# EasyEDA Pro project 无刷双驱_2025-10-18.epro, schematic Schematic1_1

## Sheets
1 P1: Board Name: Board1_1; Create Date: 2025-07-11; Page Name: P1; Project Name: 0708; Schematic Name: Schematic1_1; Update Date: 2025-07-11; Company: 嘉立创EDA; Page Size: A4; Version: V1.0
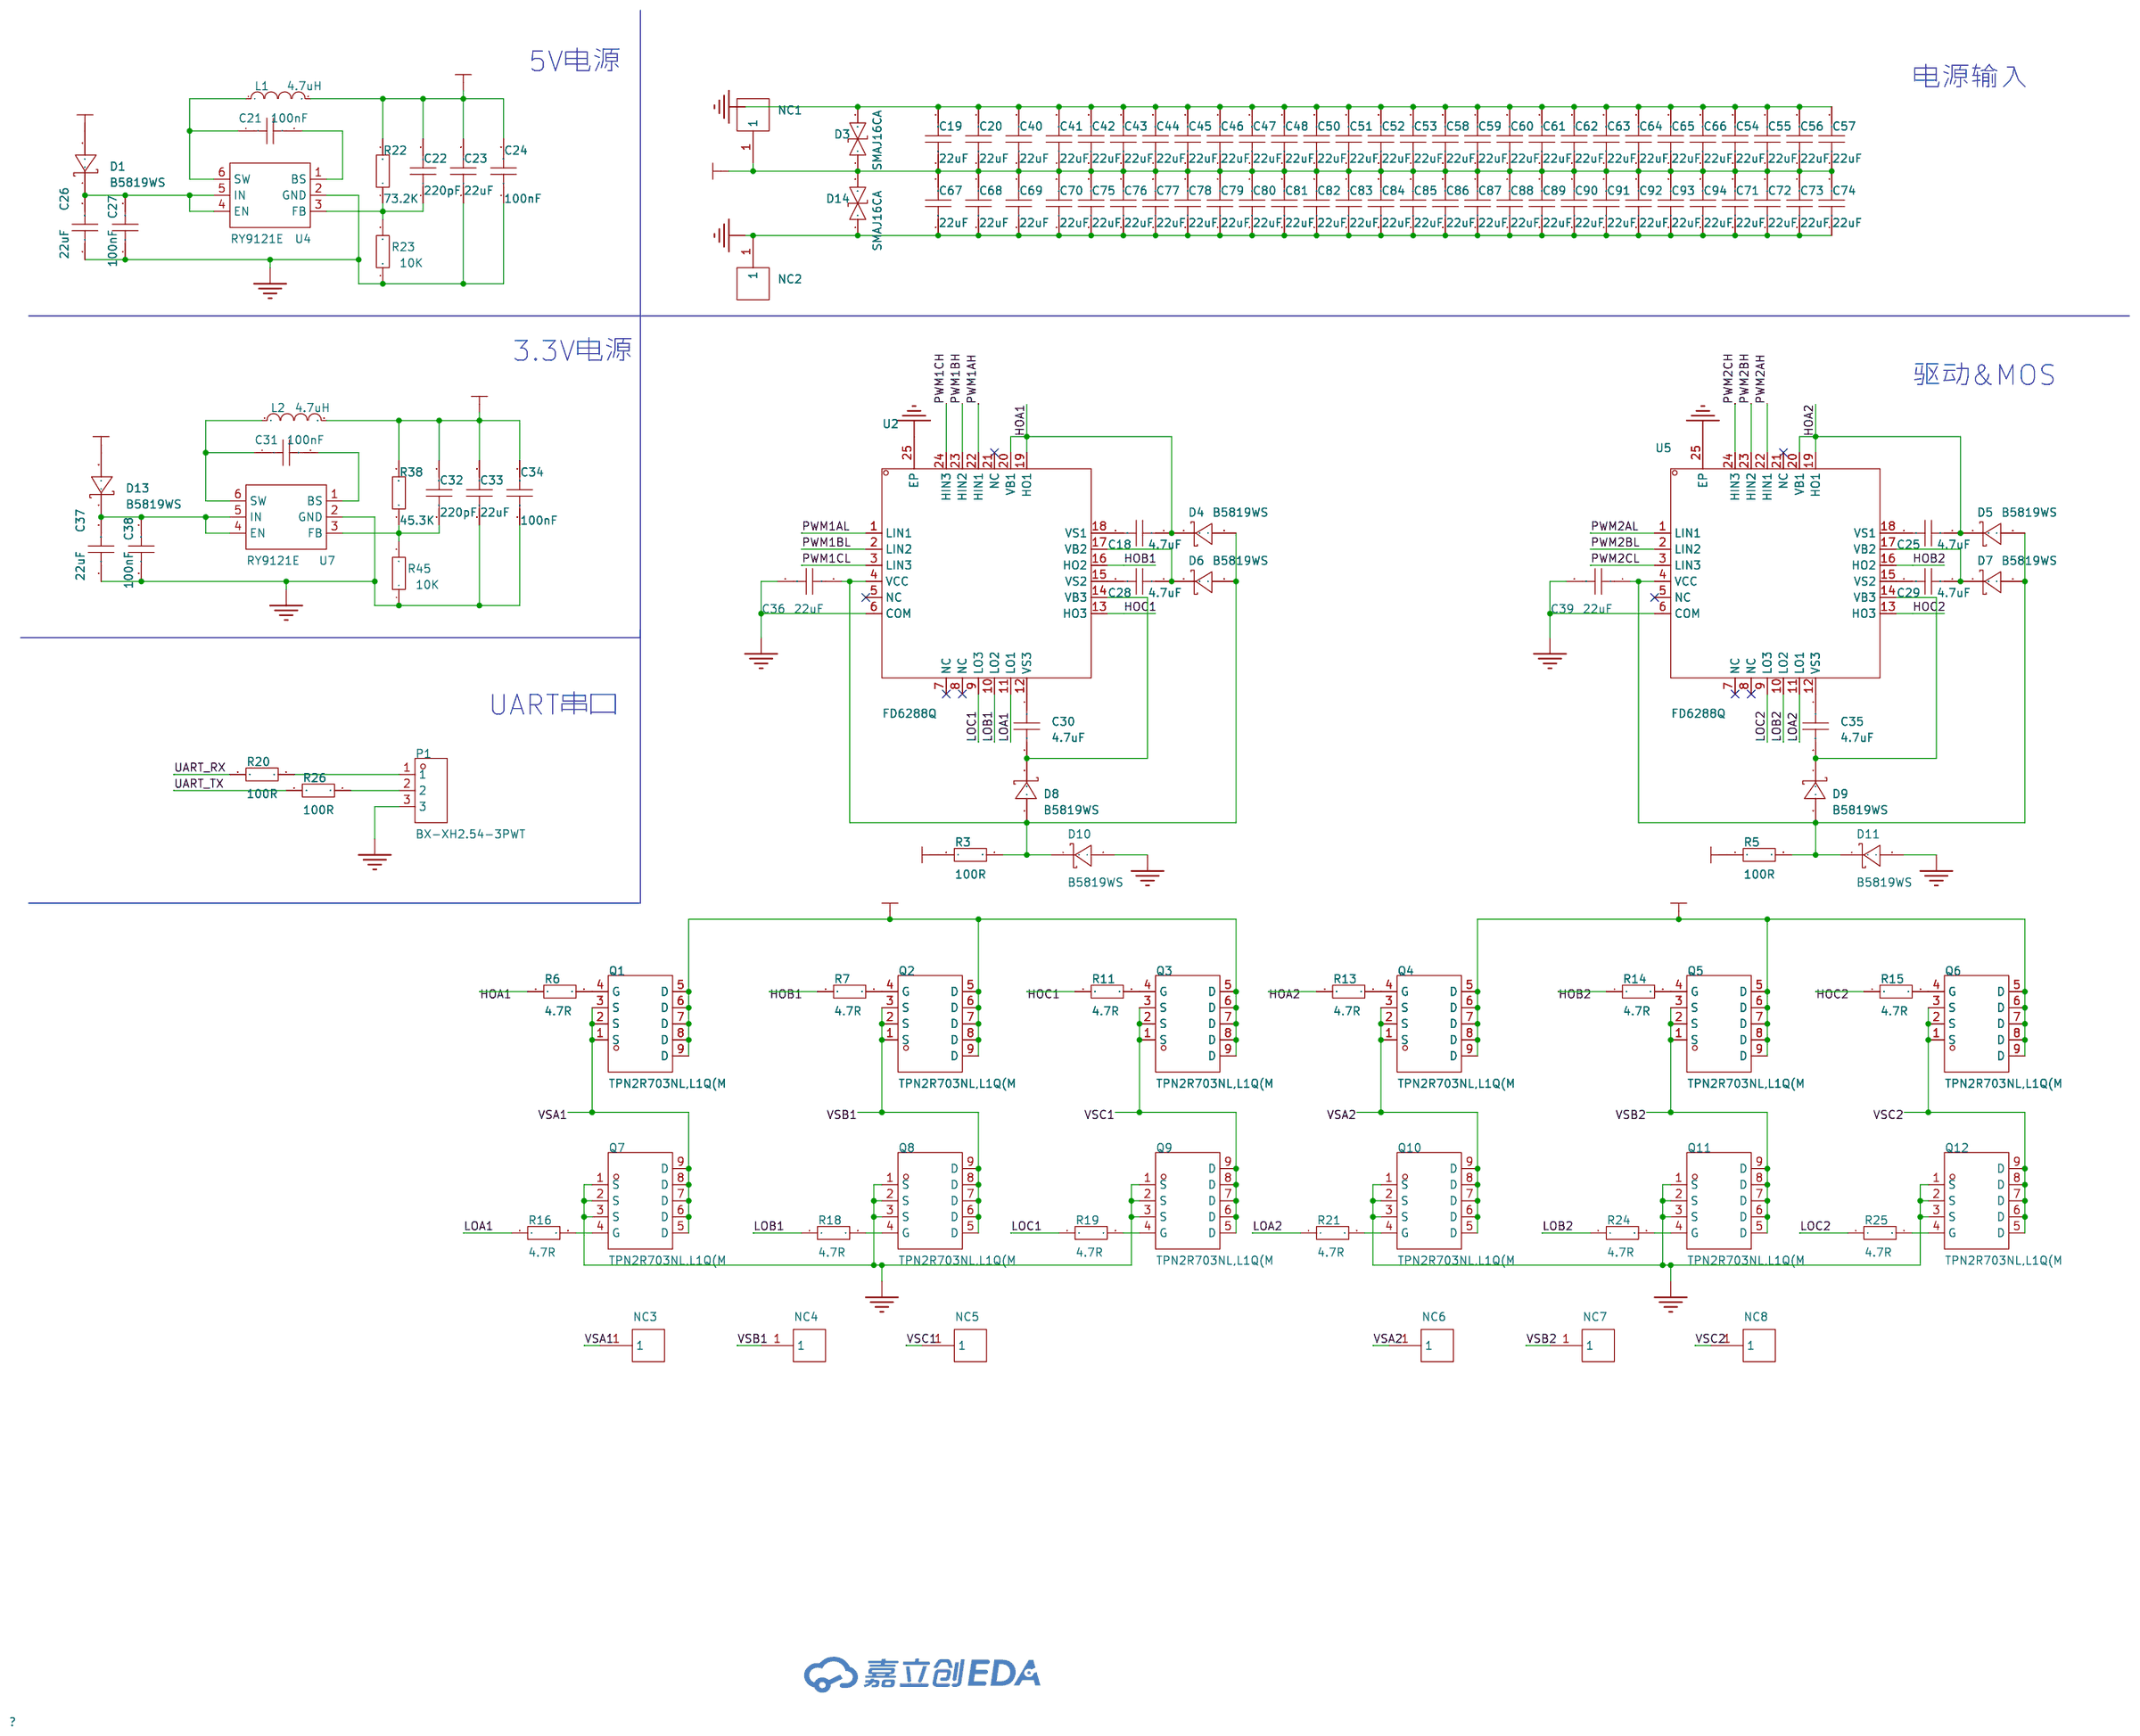
[diagram p0: P1]
2 P3: Board Name: Board1; Create Date: 2025-07-10; Page Name: P3; Project Name: 双路FOC无刷驱动; Schematic Name: Schematic1; Update Date: 2025-07-10
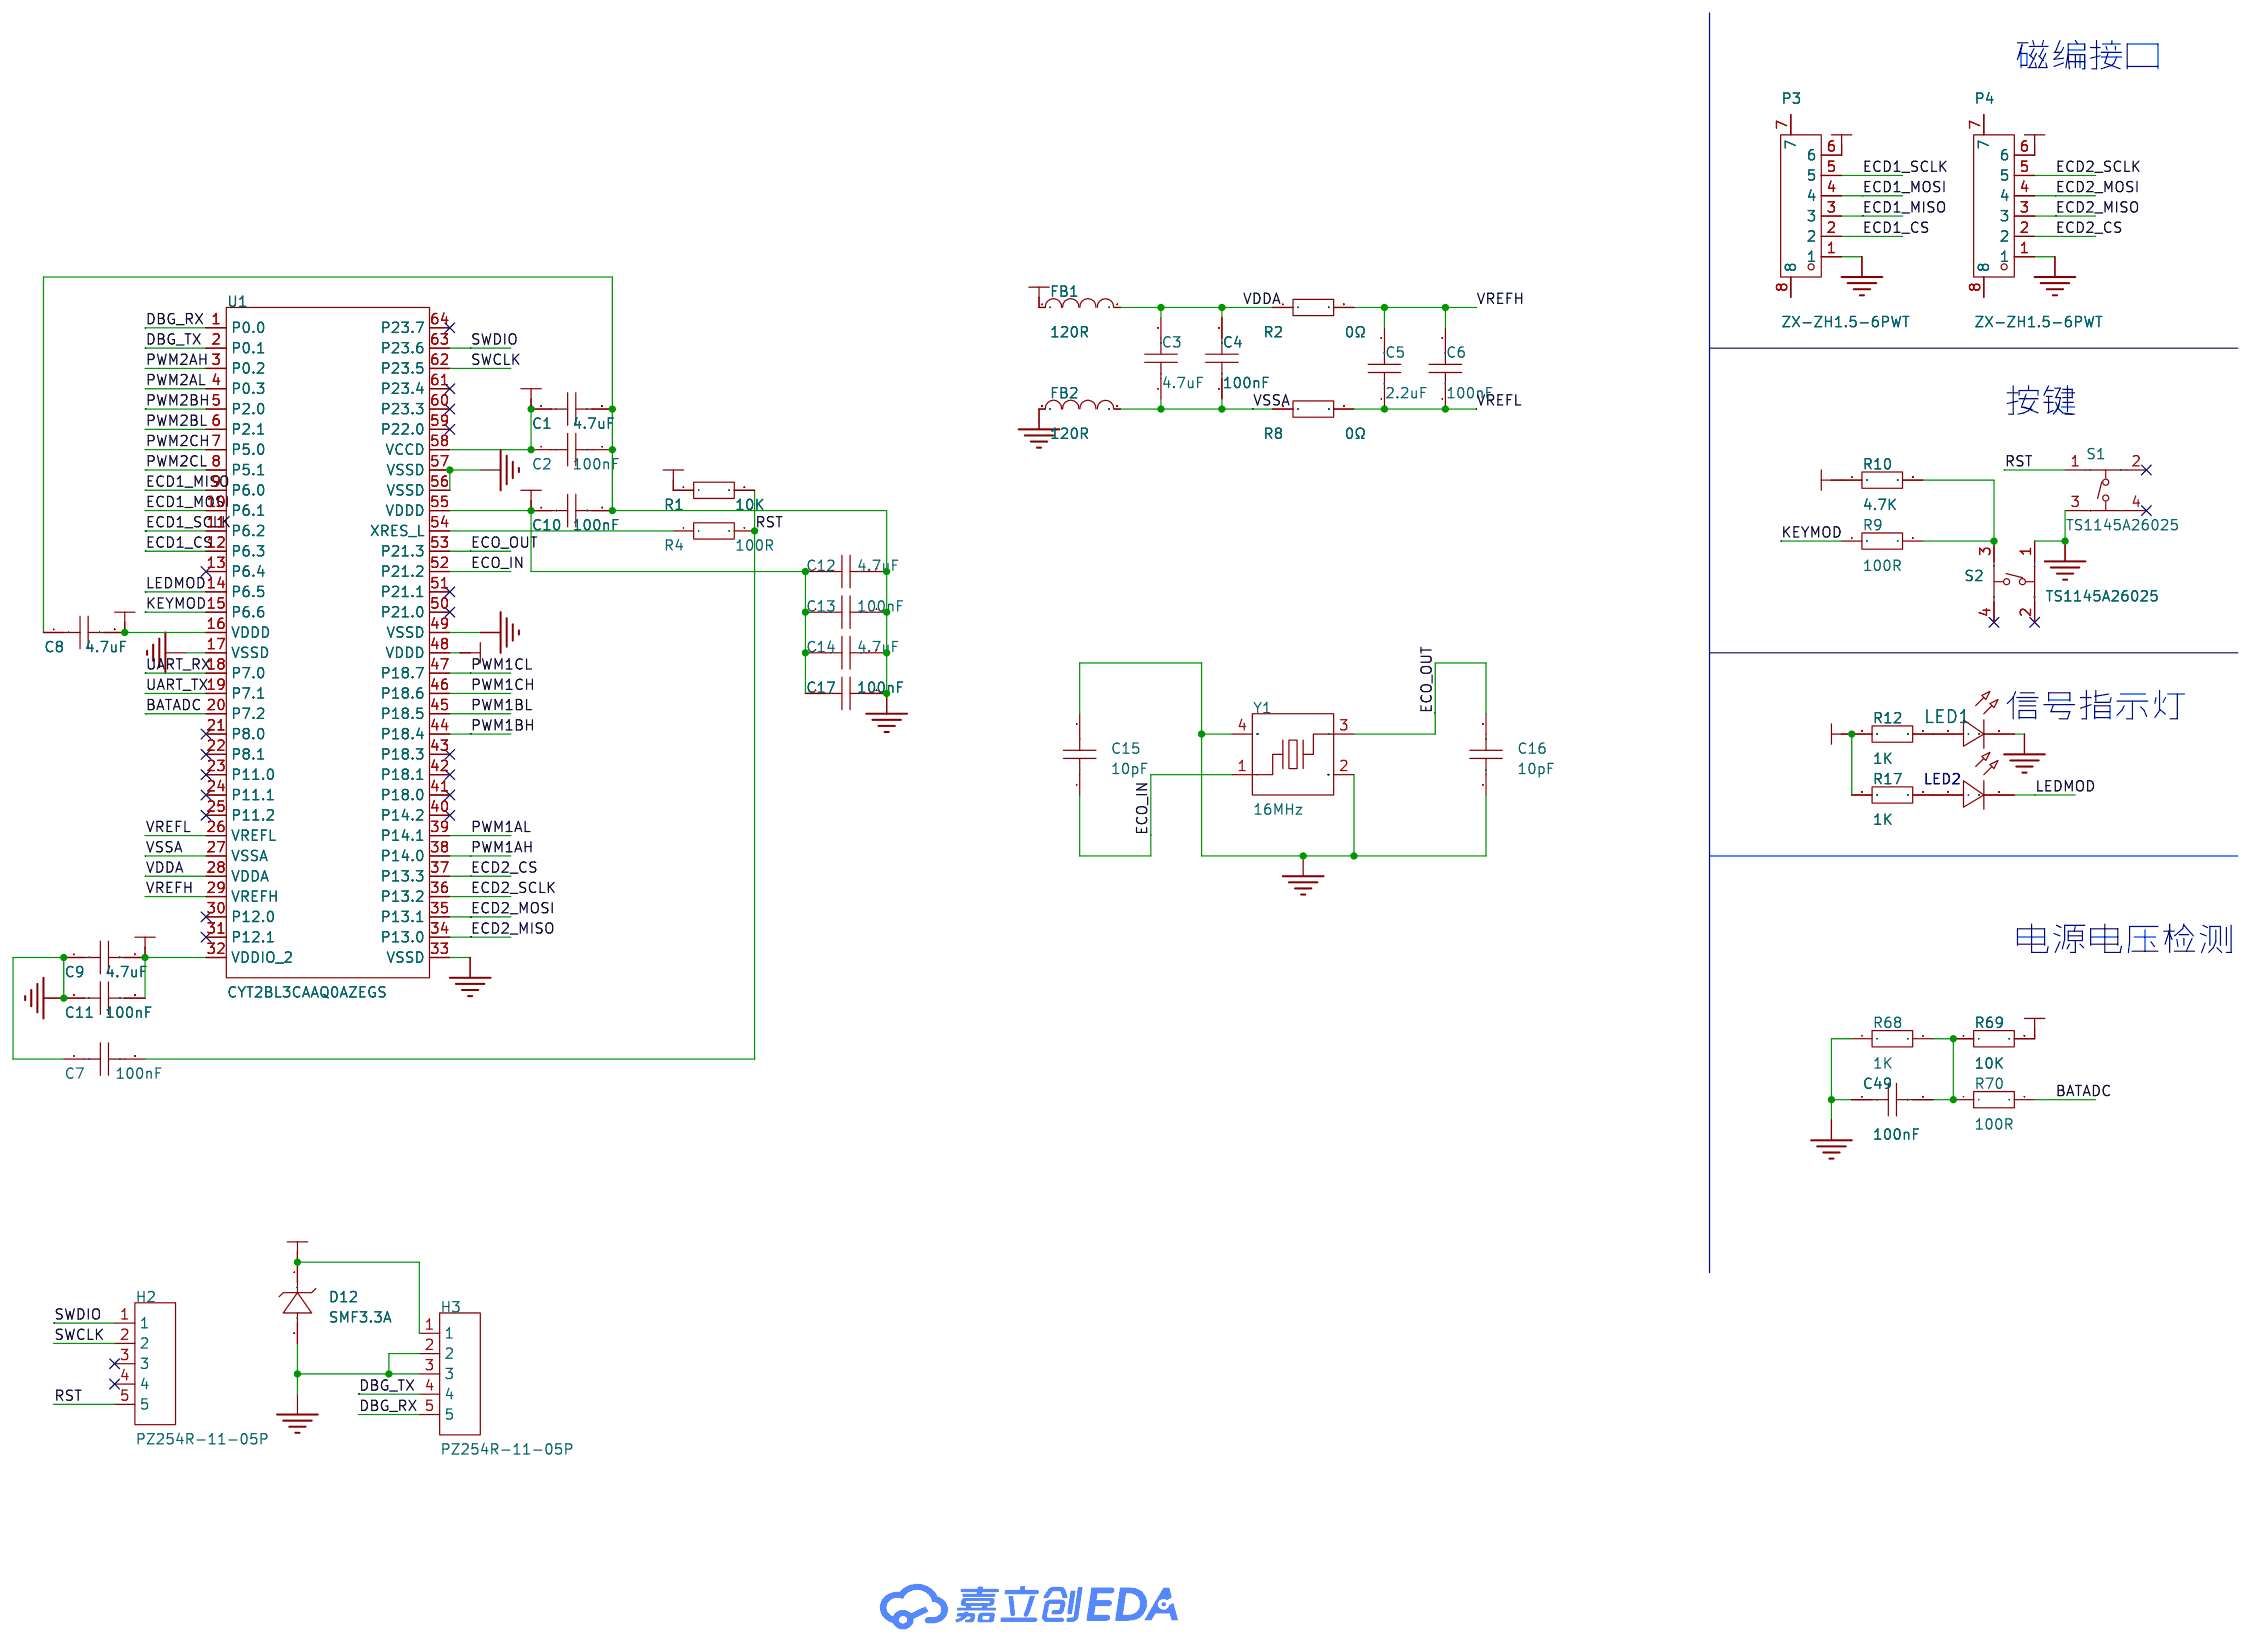
[diagram p1: P3]

## Parts
sheet P1
C18  4.7uF  [C0805]
C19  22uF  [C0805]
C20  22uF  [C0805]
C21  100nF  [C0402]
C22  220pF  [C0402]
C23  22uF  [C0805]
C24  100nF  [C0402]
C25  4.7uF  [C0805]
C26  22uF  [C0805]
C27  100nF  [C0402]
C28  4.7uF  [C0805]
C29  4.7uF  [C0805]
C30  4.7uF  [C0805]
C31  100nF  [C0402]
C32  220pF  [C0402]
C33  22uF  [C0805]
C34  100nF  [C0402]
C35  4.7uF  [C0805]
C36  22uF  [C0805]
C37  22uF  [C0805]
C38  100nF  [C0402]
C39  22uF  [C0805]
C40  22uF  [C0805]
C41  22uF  [C0805]
C42  22uF  [C0805]
C43  22uF  [C0805]
C44  22uF  [C0805]
C45  22uF  [C0805]
C46  22uF  [C0805]
C47  22uF  [C0805]
C48  22uF  [C0805]
C50  22uF  [C0805]
C51  22uF  [C0805]
C52  22uF  [C0805]
C53  22uF  [C0805]
C54  22uF  [C0805]
C55  22uF  [C0805]
C56  22uF  [C0805]
C57  22uF  [C0805]
C58  22uF  [C0805]
C59  22uF  [C0805]
C60  22uF  [C0805]
C61  22uF  [C0805]
C62  22uF  [C0805]
C63  22uF  [C0805]
C64  22uF  [C0805]
C65  22uF  [C0805]
C66  22uF  [C0805]
C67  22uF  [C0805]
C68  22uF  [C0805]
C69  22uF  [C0805]
C70  22uF  [C0805]
C71  22uF  [C0805]
C72  22uF  [C0805]
C73  22uF  [C0805]
C74  22uF  [C0805]
C75  22uF  [C0805]
C76  22uF  [C0805]
C77  22uF  [C0805]
C78  22uF  [C0805]
C79  22uF  [C0805]
C80  22uF  [C0805]
C81  22uF  [C0805]
C82  22uF  [C0805]
C83  22uF  [C0805]
C84  22uF  [C0805]
C85  22uF  [C0805]
C86  22uF  [C0805]
C87  22uF  [C0805]
C88  22uF  [C0805]
C89  22uF  [C0805]
C90  22uF  [C0805]
C91  22uF  [C0805]
C92  22uF  [C0805]
C93  22uF  [C0805]
C94  22uF  [C0805]
D1  B5819WS  [SOD-323_L1.8-W1.3-LS2.5-RD]
D3  SMAJ16CA  [SMA_L4.4-W2.6-LS5.0-BI]
D4  B5819WS  [SOD-323_L1.8-W1.3-LS2.5-RD]
D5  B5819WS  [SOD-323_L1.8-W1.3-LS2.5-RD]
D6  B5819WS  [SOD-323_L1.8-W1.3-LS2.5-RD]
D7  B5819WS  [SOD-323_L1.8-W1.3-LS2.5-RD]
D8  B5819WS  [SOD-323_L1.8-W1.3-LS2.5-RD]
D9  B5819WS  [SOD-323_L1.8-W1.3-LS2.5-RD]
D10  B5819WS  [SOD-323_L1.8-W1.3-LS2.5-RD]
D11  B5819WS  [SOD-323_L1.8-W1.3-LS2.5-RD]
D13  B5819WS  [SOD-323_L1.8-W1.3-LS2.5-RD]
D14  SMAJ16CA  [SMA_L4.4-W2.6-LS5.0-BI]
L1  4.7uH  [IND-SMD_L2.0-W1.6-B]
L2  4.7uH  [IND-SMD_L2.0-W1.6-B]
NC1  RH-5000  [TEST-TH_BD2.54-P1.4_RED]
NC2  RH-5000  [TEST-TH_BD2.54-P1.4_RED]
NC3  RH-5000  [TEST-TH_BD2.54-P1.4_RED]
NC4  RH-5000  [TEST-TH_BD2.54-P1.4_RED]
NC5  RH-5000  [TEST-TH_BD2.54-P1.4_RED]
NC6  RH-5000  [TEST-TH_BD2.54-P1.4_RED]
NC7  RH-5000  [TEST-TH_BD2.54-P1.4_RED]
NC8  RH-5000  [TEST-TH_BD2.54-P1.4_RED]
P1  BX-XH2.54-3PWT  [CONN-SMD_3P-P2.50_BX-XH2.54-3PWT]
Q1  TPN2R703NL,L1Q(M  [TSON-8_L3.1-W3.1-P0.65-LS3.3-BL-EP]
Q2  TPN2R703NL,L1Q(M  [TSON-8_L3.1-W3.1-P0.65-LS3.3-BL-EP]
Q3  TPN2R703NL,L1Q(M  [TSON-8_L3.1-W3.1-P0.65-LS3.3-BL-EP]
Q4  TPN2R703NL,L1Q(M  [TSON-8_L3.1-W3.1-P0.65-LS3.3-BL-EP]
Q5  TPN2R703NL,L1Q(M  [TSON-8_L3.1-W3.1-P0.65-LS3.3-BL-EP]
Q6  TPN2R703NL,L1Q(M  [TSON-8_L3.1-W3.1-P0.65-LS3.3-BL-EP]
Q7  TPN2R703NL,L1Q(M  [TSON-8_L3.1-W3.1-P0.65-LS3.3-BL-EP]
Q8  TPN2R703NL,L1Q(M  [TSON-8_L3.1-W3.1-P0.65-LS3.3-BL-EP]
Q9  TPN2R703NL,L1Q(M  [TSON-8_L3.1-W3.1-P0.65-LS3.3-BL-EP]
Q10  TPN2R703NL,L1Q(M  [TSON-8_L3.1-W3.1-P0.65-LS3.3-BL-EP]
Q11  TPN2R703NL,L1Q(M  [TSON-8_L3.1-W3.1-P0.65-LS3.3-BL-EP]
Q12  TPN2R703NL,L1Q(M  [TSON-8_L3.1-W3.1-P0.65-LS3.3-BL-EP]
R3  100R  [R0805]
R5  100R  [R0805]
R6  4.7R  [R0805]
R7  4.7R  [R0805]
R11  4.7R  [R0805]
R13  4.7R  [R0805]
R14  4.7R  [R0805]
R15  4.7R  [R0805]
R16  4.7R  [R0805]
R18  4.7R  [R0805]
R19  4.7R  [R0805]
R20  100R  [R0805]
R21  4.7R  [R0805]
R22  73.2K  [R0805]
R23  10K  [R0805]
R24  4.7R  [R0805]
R25  4.7R  [R0805]
R26  100R  [R0805]
R38  45.3K  [R0805]
R45  10K  [R0805]
U2  FD6288Q  [QFN-24_L4.0-W4.0-P0.50-BL-EP2.6]
U4  RY9121E  [SOT-23-6_L2.9-W1.6-P0.95-LS2.8-BL]
U5  FD6288Q  [QFN-24_L4.0-W4.0-P0.50-BL-EP2.6]
U7  RY9121E  [SOT-23-6_L2.9-W1.6-P0.95-LS2.8-BL]
sheet P3
C1  4.7uF  [C0402]
C2  100nF  [C0402]
C3  4.7uF  [C0402]
C4  100nF  [C0402]
C5  2.2uF  [C0402]
C6  100nF  [C0402]
C7  100nF  [C0402]
C8  4.7uF  [C0402]
C9  4.7uF  [C0402]
C10  100nF  [C0402]
C11  100nF  [C0402]
C12  4.7uF  [C0402]
C13  100nF  [C0402]
C14  4.7uF  [C0402]
C15  10pF  [C0402]
C16  10pF  [C0402]
C17  100nF  [C0402]
C49  100nF  [C0402]
D12  SMF3.3A  [SOD-123_L2.8-W1.8-LS3.7-RD]
FB1  120R  [L1206]
FB2  120R  [L1206]
H2  PZ254R-11-05P  [HDR-TH_5P-P2.54-H-M-W10.4]
H3  PZ254R-11-05P  [HDR-TH_5P-P2.54-H-M-W10.4]
LED1  -  [LED_0805]
LED2  -  [LED_0805]
P3  ZX-ZH1.5-6PWT  [CONN-SMD_6P-P1.50_ZX-ZH1.5-6PWT]
P4  ZX-ZH1.5-6PWT  [CONN-SMD_6P-P1.50_ZX-ZH1.5-6PWT]
R1  10K  [R0805]
R2  0Ω  [R0805]
R4  100R  [R0805]
R8  0Ω  [R0805]
R9  100R  [R0805]
R10  4.7K  [R0805]
R12  1K  [R0805]
R17  1K  [R0805]
R68  1K  [R0805]
R69  10K  [R0805]
R70  100R  [R0805]
S1  TS1145A26025  [SW-SMD_4P-L4.2-W3.2-P2.15-LS4.6]
S2  TS1145A26025  [SW-SMD_4P-L4.2-W3.2-P2.15-LS4.6]
U1  CYT2BL3CAAQ0AZEGS  [LQFP-64_L10.0-W10.0-P0.50-LS12.0-BL]
Y1  16MHz  [OSC-SMD_4P-L3.2-W2.5-BL]

## Library data of the parts
C18 C28 C30 = CL21A475KAQNNNE: 容值:4.7uF;精度:±10%;额定电压:25V;材质(温度系数):X5R;; LCSC Part Name: 4.7uF ±10% 25V; Supplier Part: C1779; Manufacturer: SAMSUNG(三星); Supplier Footprint: 0805; JLCPCB Part Class: Basic Part; Datasheet: https://atta.szlcsc.com/upload/public/pdf/source/20160218/1457707763339.pdf; Supplier: LCSC; Tolerance: ±10%; Voltage Rated: 25V; Temperature Coefficient: X5R
C19 C20 C23 C25 C26 C29 C33 C35-C37 C39-C48 C50-C94 = CGA0805X5R226M250MT: 容值:22uF;精度:±20%;额定电压:25V;温度系数:X5R;; LCSC Part Name: 22uF ±20% 25V; Supplier Part: C6119899; Manufacturer: HRE(芯声); Supplier Footprint: 0805; JLCPCB Part Class: Extended Part; Supplier: LCSC; Tolerance: ±20%; Voltage Rating: 25V; Temperature Coefficient: X5R
C2 C4 C6 C10 C11 C13 C17 C21 C24 C27 C31 C34 C38 C49 = CL05B104KO5NNNC: 容值:100nF;精度:±10%;额定电压:16V;材质(温度系数):X7R;; LCSC Part Name: 100nF ±10% 16V; Supplier Part: C1525; Manufacturer: SAMSUNG(三星); Supplier Footprint: 0402; JLCPCB Part Class: Basic Part; Datasheet: https://atta.szlcsc.com/upload/public/pdf/source/20160218/1457707763339.pdf; Supplier: LCSC; Tolerance: ±10%; Voltage Rated: 16V; Temperature Coefficient: X7R
C22 = GRM1555C1H221JA01D: 容值:220pF;精度:±5%;额定电压:50V;温度系数:C0G;; LCSC Part Name: 220pF ±5% 50V; Supplier Part: C71693; Manufacturer: muRata(村田); Supplier Footprint: 0402; JLCPCB Part Class: Extended Part; Datasheet: https://atta.szlcsc.com/upload/public/pdf/source/20161108/1478586451181.pdf; Supplier: LCSC; Tolerance: ±5%; Voltage Rating: 50V; Temperature Coefficient: C0G
C7 C32 = CAP_0402: Supplier Footprint: 0402
D1 D4-D11 D13 = B5819WS_C64886: 二极管配置:独立式;正向压降(Vf):900mV@3A;直流反向耐压(Vr):40V;整流电流:1A;; LCSC Part Name: 电压:40V 电流:1A 丝印SL; Supplier Part: C64886; Manufacturer: MDD(辰达半导体); Supplier Footprint: SOD-323; JLCPCB Part Class: 扩展库; Datasheet: https://atta.szlcsc.com/upload/public/pdf/source/20241121/165544ED2364DF4F1DA9A28474F8D736.pdf; Supplier: LCSC; Diode Configuration: 独立式; Forward Voltage (Vf@If): 900mV@3A; Reverse Voltage (Vr): 40V; Rectified Current: 1A; Reverse Leakage Current (Ir): 1mA@40V
D3 D14 = SMAJ16CA_C148217: 反向截止电压(Vrwm):16V;最大钳位电压:26V;峰值脉冲电流(Ipp)@10/1000us:15.4A;峰值脉冲功率(Ppp)@10/1000us:400W;击穿电压:17.8V;; LCSC Part Name: 双向TVS 16V截止 15.4A峰值脉冲; Supplier Part: C148217; Manufacturer: Littelfuse(美国力特); Supplier Footprint: SMA(DO-214AC); JLCPCB Part Class: 扩展库; Datasheet: https://atta.szlcsc.com/upload/public/pdf/source/20190402/C374025_5ACE77BC72947DF13CF0CBC7F8B57228.pdf; Supplier: LCSC; Reverse Stand-Off Voltage (Vrwm): 16V; Maximum Clamping Voltage: 26V; Peak Pulse Current (Ipp)@10/1000us: 15.4A; Peak Pulse Power Dissipation (Ppp)@10/1000us: 400W; Breakdown Voltage: 17.8V; Type: TVS
L1 L2 = FTC201610S4R7MBCA: 电感值:4.7uH;精度:±20%;额定电流:1.6A;饱和电流(Isat):2A;类型:一体成型电感;; LCSC Part Name: 4.7uH ±20% 2A; Supplier Part: C5832346; Manufacturer: cjiang(长江微电); Supplier Footprint: SMD,1.6x2mm; JLCPCB Part Class: Extended Part; Datasheet: https://atta.szlcsc.com/upload/public/pdf/source/20230602/8FFEDA9C0247A92A0D4B67554BFE4091.pdf; Supplier: LCSC; Tolerance: ±20%; Rated Current: 1.6A; Saturation Current (Isat): 2A; DC Resistance (DCR): 190mΩ; Type: 一体成型电感
NC1-NC8 = RH-5000: LCSC Part Name: PCB电路板测试点/测试针; Supplier Part: C5277086; Manufacturer: 荣和; JLCPCB Part Class: 扩展库; Datasheet: https://atta.szlcsc.com/upload/public/pdf/source/20230704/1671C2774A3D6CEDC1FD6AAF48538C87.pdf; Supplier: LCSC
P1 = BX-XH2.54-3PWT: 插针结构:1x3P;间距:2.5mm;安装方式:卧贴;参考系列:XH;总PIN数:3P;排数:1;每排PIN数:3;行距:-;额定电流:3A;触头材质:黄铜;触头镀层:锡;工作温度:-25℃~+85℃;; LCSC Part Name: 1x3P 间距:2.5mm 卧贴 系列:XH; Supplier Part: C18077873; Manufacturer: Bossie(博锡); Supplier Footprint: SMD,P=2.54mm,卧贴; JLCPCB Part Class: Extended Part; Datasheet: https://atta.szlcsc.com/upload/public/pdf/source/20231017/EDA27ED746708C958B6F1C9F7AF7FBE7.pdf; Supplier: LCSC; Pins Structure: 1x3P; Pitch: 2.5mm; Mounting Type: 卧贴; Reference Series: XH; Number of Pins: 3P; Number of Rows: 1; Number of PINs Per Row: 3; Current Rating: 3A; Contact Material: 黄铜; Contact Plating: 锡; Operating Temperature: -25℃~+85℃; Voltage Rating: 250V; Plastic Material: LCP; Supplementary Features: 辅助焊脚; Color: 米色; Z-Height of the Board: 6.2mm; X-Length of Bottom Edge on Board (Spacing Line): 12.5mm; Y-Width of Bottom Edge on Board: 10.5mm
Q1-Q12 = TPN2R703NL,L1Q(M: 类型:1个N沟道;漏源电压(Vdss):30V;连续漏极电流(Id):-;导通电阻(RDS(on)@Vgs,Id):3.3mΩ@4.5V,22.5A;功率:42W;阈值电压(Vgs(th)@Id):1.3V@0.3mA;; Supplier Part: C5307666; Manufacturer: TOSHIBA(东芝); Supplier Footprint: TSON-8; JLCPCB Part Class: 扩展库; Datasheet: https://atta.szlcsc.com/upload/public/pdf/source/20221207/F3F28B90115C5E074AC0CD2ED28456D7.pdf; Supplier: LCSC; Type: 1个N沟道; Drain Source Voltage (Vdss): 30V; Drain Source On Resistance (RDS(on)@Vgs,Id): 3.3mΩ@4.5V,22.5A; Power Dissipation (Pd): 42W; Gate Threshold Voltage (Vgs(th)@Id): 1.3V@0.3mA; Input Capacitance (Ciss@Vds): 1.6nF@15V; Reverse Transfer Capacitance (Crss@Vds): 53pF@15V
R1 R3-R7 R9-R26 R38 R45 R68-R70 = Res_0805: Supplier Footprint: 0805
U2 U5 = FD6288Q: Supplier Part: C328453; Manufacturer: Fortior Tech(峰岹); Supplier Footprint: QFN-24-EP(4x4); JLCPCB Part Class: 扩展库; Datasheet: https://atta.szlcsc.com/upload/public/pdf/source/20241101/0E2856EB301EAFFED732065FB088D773.pdf; Supplier: LCSC
U4 U7 = RY9121E: Supplier Part: C22392164; Manufacturer: RYCHiP(蕊源); Supplier Footprint: SOT-23-6; JLCPCB Part Class: 扩展库; Supplier: LCSC
C1 C3 C8 C9 C12 C14 = CL05A475MP5NRNC: 容值:4.7uF;精度:±20%;额定电压:10V;材质(温度系数):X5R;; LCSC Part Name: 4.7uF ±20% 10V; Supplier Part: C23733; Manufacturer: SAMSUNG(三星); Supplier Footprint: 0402; JLCPCB Part Class: Basic Part; Datasheet: https://atta.szlcsc.com/upload/public/pdf/source/20160218/1457707763339.pdf; Supplier: LCSC; Tolerance: ±20%; Voltage Rated: 10V; Temperature Coefficient: X5R
C5 = CL05A225KP5NSNC: 容值:2.2uF;精度:±10%;额定电压:10V;材质(温度系数):X5R;; LCSC Part Name: 2.2uF ±10% 10V; Supplier Part: C107369; Manufacturer: SAMSUNG(三星); Supplier Footprint: 0402; JLCPCB Part Class: Extended Part; Datasheet: https://atta.szlcsc.com/upload/public/pdf/source/20160218/1457707763339.pdf; Supplier: LCSC; Tolerance: ±10%; Voltage Rated: 10V; Temperature Coefficient: X5R
C15 C16 = CL05C100JB5NNNC: 容值:10pF;精度:±5%;额定电压:50V;材质(温度系数):C0G;; LCSC Part Name: 10pF ±5% 50V; Supplier Part: C32949; Manufacturer: SAMSUNG(三星); Supplier Footprint: 0402; JLCPCB Part Class: Basic Part; Datasheet: https://atta.szlcsc.com/upload/public/pdf/source/20160218/1457707763339.pdf; Supplier: LCSC; Tolerance: ±5%; Voltage Rated: 50V; Temperature Coefficient: C0G
D12 = SMF3.3A: 反向截止电压(Vrwm):3.3V;最大钳位电压:7.3V;峰值脉冲电流(Ipp)@10/1000us:27A;击穿电压:4.1V;; LCSC Part Name: 停产; Supplier Part: C717050; Manufacturer: FMS(美丽微); Supplier Footprint: SOD-123; JLCPCB Part Class: 扩展库; Datasheet: https://atta.szlcsc.com/upload/public/pdf/source/20200814/C717050_265AFBA9FDC1939BED2FD639E25FA6BB.pdf; Supplier: LCSC; Reverse Stand-Off Voltage (Vrwm): 3.3V; Maximum Clamping Voltage: 7.3V; Peak Pulse Current (Ipp)@10/1000us: 27A; Breakdown Voltage: 4.1V; Reverse Leakage Current (Ir): 30uA; Type: TVS
FB1 FB2 = CBG321609U121T: 阻抗@频率:120Ω@100MHz;误差:±25%;直流电阻(DCR):150mΩ;; LCSC Part Name: 单路 1206磁珠 阻抗120Ω@100MHz; Supplier Part: C39279; Manufacturer: FH(风华); Supplier Footprint: 1206; JLCPCB Part Class: 扩展库; Datasheet: https://atta.szlcsc.com/upload/public/pdf/source/20190129/C361667_1614D407CC98D1D3CFBD9E1F7511C14D.pdf; Supplier: LCSC; Impedance @ Frequency: 120Ω@100MHz; Tolerance: ±25%; DC Resistance(DCR): 150mΩ; Current Rating: 1A; Number of Circuits: 1
H2 H3 = PZ254R-11-05P: 插针结构:1x5P;间距:2.54mm;行距:-;圆针/方针:方针;安装方式:弯插;排数:单排;总PIN位数:5P;额定电流:-;额定电压:-;配合针长度:6mm;塑高:2.5mm;触头材质:黄铜;触头镀层:-;工作温度:-40℃~+105℃;颜色:黑色;; LCSC Part Name: 1x5P 间距:2.54mm 方针 弯插; Supplier Part: C492413; Manufacturer: XFCN(兴飞); Supplier Footprint: 弯插,P=2.54mm; JLCPCB Part Class: 扩展库; Datasheet: https://atta.szlcsc.com/upload/public/pdf/source/20200309/C492413_82088D06BDD816AEC12FB986624DD327.pdf; Supplier: LCSC; Pin Structure: 1x5P; Pitch: 2.54mm; Circluar Pins/Square Pins: 方针; Mounting Type: 弯插; Number of Rows: 单排; Number of Pins: 5P; Length of Mating Pin: 6mm; Insulation Height: 2.5mm; Contact Material: 黄铜; Operating Temperature: -40℃~+105℃; Color: 黑色
LED1 = LED_0805-R: Supplier Footprint: 0805
LED2 = LED_0805-B: Supplier Footprint: 0805
P3 P4 = ZX-ZH1.5-6PWT: 插针结构:1x6P;间距:1.5mm;安装方式:卧贴;参考系列:ZH;总PIN数:6P;排数:1;每排PIN数:6;行距:-;额定电流:1A;触头材质:黄铜;触头镀层:锡;工作温度范围:-25℃~+85℃;; LCSC Part Name: 1x6P 间距:1.5mm 卧贴 系列:ZH; Supplier Part: C19272409; Manufacturer: Megastar(兆星); Supplier Footprint: SMD,P=1.5mm,卧贴; JLCPCB Part Class: 扩展库; Datasheet: https://atta.szlcsc.com/upload/public/pdf/source/20231201/C5A824B953C40A6060EBF5A541254C86.pdf; Supplier: LCSC; Pins Structure: 1x6P; Pitch: 1.5mm; Mounting Type: 卧贴; Reference Series: ZH; Number of Pins: 6P; Number of Rows: 1; Number of PINs Per Row: 6; Rated Current: 1A; Contact Material: 黄铜; Contact Plating: 锡; Operating Temperature: -25℃~+85℃; Rated Voltage (Max): 250V; Plastic Material: LCP; Supplementary Features: 辅助焊脚; Color: 米色; Z-Height of the Board: 3.8mm; X-Length of Bottom Edge on Board (Spacing Line): 12mm; Y-Width of Bottom Edge on Board: 6.5mm
R2 R8 = 0805W8F0000T5E: 电阻类型:厚膜电阻;阻值:0Ω;精度:±1%;功率:125mW;最大工作电压:150V;温度系数:±800ppm/℃;; LCSC Part Name: 0Ω ±1% 125mW 厚膜电阻; Supplier Part: C17477; Manufacturer: UNI-ROYAL(厚声); Supplier Footprint: 0805; JLCPCB Part Class: 基础库; Datasheet: https://atta.szlcsc.com/upload/public/pdf/source/20200306/C422600_1E6D84923E4A46A82E41ADD87F860B5C.pdf; Supplier: LCSC; Type: 厚膜电阻; Tolerance: ±1%; Power(Watts): 125mW; Overload Voltage (Max): 150V; Temperature Coefficient: ±800ppm/℃; Operating Temperature Range: -55℃~+155℃
S1 S2 = TS1145A26025: Supplier Part: C22375315; Manufacturer: HanElectricity(瀚源); Supplier Footprint: SMD-4P,4.2x3.2mm; JLCPCB Part Class: 扩展库; Datasheet: https://atta.szlcsc.com/upload/public/pdf/source/20240426/BE19A9ACDD8195A867E04CF99141E744.pdf; Supplier: LCSC
U1 = CYT2BL3CAAQ0AZEGS: CPU内核:ARM-M4F；ARM-M0+;CPU最大主频:100MHz；160MHz;应用领域:-;; Supplier Part: C5613683; Manufacturer: Infineon(英飞凌); Supplier Footprint: LQFP-64(10x10); JLCPCB Part Class: 扩展库; Datasheet: https://atta.szlcsc.com/upload/public/pdf/source/20241028/9C5F45A22757023D6821BF2A2597B3D9.pdf; Supplier: LCSC; CPU Core: ARM-M4F；ARM-M0+; CPU Maximum Speed: 100MHz；160MHz; Number of I/O: 49; ADC (Bit): 12bit; Voltage - Supply: 2.7V~5.5V
Y1 = X322516MLB4SI: 晶振类型:贴片晶振;频率:16MHz;常温频差:±10ppm;负载电容:9pF;频率稳定度:±20ppm;; LCSC Part Name: YSX321SL 16MHZ 4P 3225 9PF ±10PPM -40~85℃ (±20PPM); Supplier Part: C13738; Manufacturer: YXC(扬兴晶振); Supplier Footprint: SMD3225-4P; JLCPCB Part Class: Basic Part; Datasheet: https://atta.szlcsc.com/upload/public/pdf/source/20240329/19D5F850207469550BEB00D7DFEDBC7A.pdf; Supplier: LCSC; Type: 贴片晶振; Normal temperature Frequency Tolerance: ±10ppm; Load Capacitance: 9pF; Frequency Stability: ±20ppm; Operating Temperature: -40℃~+85℃

## Nets
GND: C1.2 C2.2 C7.1 C8.1 C9.1 C10.2 C11.1 C12.2 C13.2 C14.2 C15.2 C16.1 C17.2 C19.2 C20.2 C23.1 C24.1 C26.1 C27.1 C33.1 C34.1 C36.2 C37.1 C38.1 C39.2 C40.2 C41.2 C42.2 C43.2 C44.2 C45.2 C46.2 C47.2 C48.2 C49.1 C50.2 C51.2 C52.2 C53.2 C54.2 C55.2 C56.2 C57.2 C58.2 C59.2 C60.2 C61.2 C62.2 C63.2 C64.2 C65.2 C66.2 C67.1 C68.1 C69.1 C70.1 C71.1 C72.1 C73.1 C74.1 C75.1 C76.1 C77.1 C78.1 C79.1 C80.1 C81.1 C82.1 C83.1 C84.1 C85.1 C86.1 C87.1 C88.1 C89.1 C90.1 C91.1 C92.1 C93.1 C94.1 D3.2 D10.2(A) D11.2(A) D12.2(A) D14.1 FB2.1 H3.2 H3.3 LED1.1(C) NC2.1 P1.3 P3.1 P4.1 Q7.1(S) Q7.2(S) Q7.3(S) Q8.1(S) Q8.2(S) Q8.3(S) Q9.1(S) Q9.2(S) Q9.3(S) Q10.1(S) Q10.2(S) Q10.3(S) Q11.1(S) Q11.2(S) Q11.3(S) Q12.1(S) Q12.2(S) Q12.3(S) R23.1 R45.1 R68.1 S1.3 S2.1 U1.17(VSSD) U1.33(VSSD) U1.49(VSSD) U1.56(VSSD) U1.57(VSSD) U2.6(COM) U2.25(EP) U4.2(GND) U5.6(COM) U5.25(EP) U7.2(GND) Y1.2(GND) Y1.4(GND)
VBAT: C19.1 C20.1 C40.1 C41.1 C42.1 C43.1 C44.1 C45.1 C46.1 C47.1 C48.1 C50.1 C51.1 C52.1 C53.1 C54.1 C55.1 C56.1 C57.1 C58.1 C59.1 C60.1 C61.1 C62.1 C63.1 C64.1 C65.1 C66.1 C67.2 C68.2 C69.2 C70.2 C71.2 C72.2 C73.2 C74.2 C75.2 C76.2 C77.2 C78.2 C79.2 C80.2 C81.2 C82.2 C83.2 C84.2 C85.2 C86.2 C87.2 C88.2 C89.2 C90.2 C91.2 C92.2 C93.2 C94.2 D1.2(A) D3.1 D13.2(A) D14.2 NC1.1 Q1.5(D) Q1.6(D) Q1.7(D) Q1.8(D) Q1.9(D) Q2.5(D) Q2.6(D) Q2.7(D) Q2.8(D) Q2.9(D) Q3.5(D) Q3.6(D) Q3.7(D) Q3.8(D) Q3.9(D) Q4.5(D) Q4.6(D) Q4.7(D) Q4.8(D) Q4.9(D) Q5.5(D) Q5.6(D) Q5.7(D) Q5.8(D) Q5.9(D) Q6.5(D) Q6.6(D) Q6.7(D) Q6.8(D) Q6.9(D) R3.1 R5.1 R69.2
VCC1V1: C1.1 C2.1 U1.58(VCCD)
VCC3.3V: C8.2 C9.2 C10.1 C11.2 C12.1 C13.1 C14.1 C17.1 C32.2 C33.2 C34.2 D12.1(C) FB1.1 H3.1 L2.2 R1.1 R10.1 R12.1 R17.1 R38.2 U1.16(VDDD) U1.32(VDDIO_2) U1.48(VDDD) U1.55(VDDD)
VCC5V: C22.2 C23.2 C24.2 L1.2 P3.6 P4.6 R22.2
VDDA: C3.2 C4.2 FB1.2 R2.1 U1.28(VDDA)
VSSA: C3.1 C4.1 FB2.2 R8.1 U1.27(VSSA)
BATADC: R70.2 U1.20(P7.2)
DBG_RX: H3.5 U1.1(P0.0)
DBG_TX: H3.4 U1.2(P0.1)
ECD1_CS: P3.2 U1.12(P6.3)
ECD1_MISO: P3.3 U1.9(P6.0)
ECD1_MOSI: P3.4 U1.10(P6.1)
ECD1_SCLK: P3.5 U1.11(P6.2)
ECD2_CS: P4.2 U1.37(P13.3)
ECD2_MISO: P4.3 U1.34(P13.0)
ECD2_MOSI: P4.4 U1.35(P13.1)
ECD2_SCLK: P4.5 U1.36(P13.2)
ECO_IN: C15.1 U1.52(P21.2) Y1.1
ECO_OUT: C16.2 U1.53(P21.3) Y1.3
HOA1: R6.1 U2.19(HO1)
HOA2: R13.1 U5.19(HO1)
HOB1: R7.1 U2.16(HO2)
HOB2: R14.1 U5.16(HO2)
HOC1: R11.1 U2.13(HO3)
HOC2: R15.1 U5.13(HO3)
KEYMOD: R9.1 U1.15(P6.6)
LEDMOD: LED2.1(C) U1.14(P6.5)
LOA1: R16.1 U2.11(LO1)
LOA2: R21.1 U5.11(LO1)
LOB1: R18.1 U2.10(LO2)
LOB2: R24.1 U5.10(LO2)
LOC1: R19.1 U2.9(LO3)
LOC2: R25.1 U5.9(LO3)
PWM1AH: U1.38(P14.0) U2.22(HIN1)
PWM1AL: U1.39(P14.1) U2.1(LIN1)
PWM1BH: U1.44(P18.4) U2.23(HIN2)
PWM1BL: U1.45(P18.5) U2.2(LIN2)
PWM1CH: U1.46(P18.6) U2.24(HIN3)
PWM1CL: U1.47(P18.7) U2.3(LIN3)
PWM2AH: U1.3(P0.2) U5.22(HIN1)
PWM2AL: U1.4(P0.3) U5.1(LIN1)
PWM2BH: U1.5(P2.0) U5.23(HIN2)
PWM2BL: U1.6(P2.1) U5.2(LIN2)
PWM2CH: U1.7(P5.0) U5.24(HIN3)
PWM2CL: U1.8(P5.1) U5.3(LIN3)
RST: C7.2 H2.5 R1.2 R4.2 S1.1
SWCLK: H2.2 U1.62(P23.5)
SWDIO: H2.1 U1.63(P23.6)
UART_RX: R20.2 U1.18(P7.0)
UART_TX: R26.2 U1.19(P7.1)
VREFH: C5.2 C6.2 R2.2 U1.29(VREFH)
VREFL: C5.1 C6.1 R8.2 U1.26(VREFL)
VSA1: NC3.1 Q1.1(S) Q1.2(S) Q1.3(S) Q7.5(D) Q7.6(D) Q7.7(D) Q7.8(D) Q7.9(D)
VSA2: NC6.1 Q4.1(S) Q4.2(S) Q4.3(S) Q10.5(D) Q10.6(D) Q10.7(D) Q10.8(D) Q10.9(D)
VSB1: NC4.1 Q2.1(S) Q2.2(S) Q2.3(S) Q8.5(D) Q8.6(D) Q8.7(D) Q8.8(D) Q8.9(D)
VSB2: NC7.1 Q5.1(S) Q5.2(S) Q5.3(S) Q11.5(D) Q11.6(D) Q11.7(D) Q11.8(D) Q11.9(D)
VSC1: NC5.1 Q3.1(S) Q3.2(S) Q3.3(S) Q9.5(D) Q9.6(D) Q9.7(D) Q9.8(D) Q9.9(D)
VSC2: NC8.1 Q6.1(S) Q6.2(S) Q6.3(S) Q12.5(D) Q12.6(D) Q12.7(D) Q12.8(D) Q12.9(D)
$1N501: C26.2 C27.2 D1.1(K) U4.4(EN) U4.5(IN)
$1N557: C21.1 L1.1 U4.6(SW)
$1N566: C21.2 U4.1(BS)
$1N644: C22.1 R22.1 R23.2 U4.3(FB)
$1N1214: C32.1 R38.1 R45.2 U7.3(FB)
$1N1220: C31.2 U7.1(BS)
$1N1247: C37.2 C38.2 D13.1(K) U7.4(EN) U7.5(IN)
$1N1253: C31.1 L2.1 U7.6(SW)
$1N1472: P1.1 R20.1
$1N1476: P1.2 R26.1
$1N6025: C36.1 D4.2(A) D6.2(A) D8.2(A) D10.1(K) R3.2 U2.4(VCC)
$1N6283: C30.1 U2.12(VS3)
$1N6285: C28.2 U2.15(VS2)
$1N6287: C18.2 U2.18(VS1)
$1N6291: C30.2 D8.1(K) U2.14(VB3)
$1N6297: C28.1 D6.1(K) U2.17(VB2)
$1N6302: C18.1 D4.1(K) U2.20(VB1)
$1N6836: Q1.4(G) R6.2
$1N7137: Q2.4(G) R7.2
$1N7325: Q3.4(G) R11.2
$1N7915: C39.1 D5.2(A) D7.2(A) D9.2(A) D11.1(K) R5.2 U5.4(VCC)
$1N7926: C35.2 D9.1(K) U5.14(VB3)
$1N7930: C35.1 U5.12(VS3)
$1N7941: C25.1 D5.1(K) U5.20(VB1)
$1N7948: C29.2 U5.15(VS2)
$1N7950: C29.1 D7.1(K) U5.17(VB2)
$1N7956: C25.2 U5.18(VS1)
$1N8558: Q5.4(G) R14.2
$1N8585: Q6.4(G) R15.2
$1N8605: Q4.4(G) R13.2
$1N11687: Q10.4(G) R21.2
$1N11719: Q9.4(G) R19.2
$1N11741: Q8.4(G) R18.2
$1N11762: Q7.4(G) R16.2
$1N11822: Q11.4(G) R24.2
$1N11840: Q12.4(G) R25.2
$3N600: R9.2 R10.2 S2.3
$3N887: LED1.2(A) R12.2
$3N939: LED2.2(A) R17.2
$3N1087: C49.2 R68.2 R69.1 R70.1
$3N2329: R4.1 U1.54(XRES_L)

Not connected (* = marked no-connect by the designer): H2 3* 4*; P3 7 8; P4 7 8; S1 2* 4*; S2 2* 4*; U1 13(P6.4)* 21(P8.0)* 22(P8.1)* 23(P11.0)* 24(P11.1)* 25(P11.2)* 30(P12.0)* 31(P12.1)* 40(P14.2)* 41(P18.0)* 42(P18.1)* 43(P18.3)* 50(P21.0)* 51(P21.1)* 59(P22.0)* 60(P23.3)* 61(P23.4)* 64(P23.7)*; U2 5(NC)* 7(NC)* 8(NC)* 21(NC)*; U5 5(NC)* 7(NC)* 8(NC)* 21(NC)*

## Notes on the sheets
sheet 1
- 5V电源
- 电源输入
- 3.3V电源
- 驱动&MOS
- UART串口
sheet 2
- 磁编接口
- 按键
- 信号指示灯
- 电源电压检测
